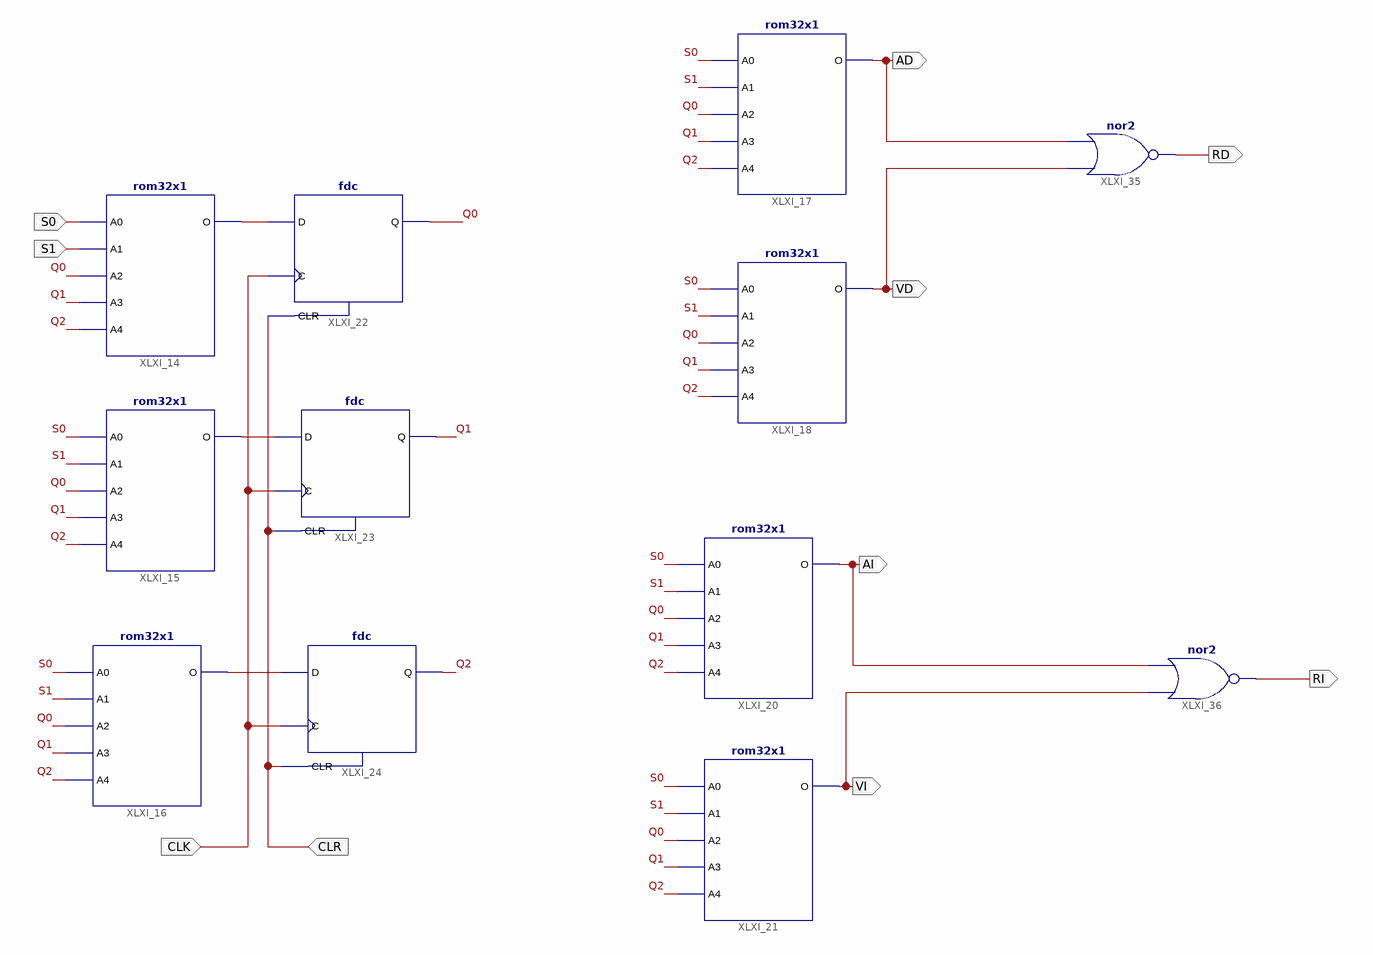
[diagram p0: schematic sheet 1]
// Xilinx ISE schematic p4ej2_1.sch (spartan3) as structural Verilog: 12 symbols, 10 ports
module p4ej2_1 (
  input  CLK,
  input  CLR,
  input  S0,
  input  S1,
  output RD,
  output RI,
  output VI,
  output AI,
  output VD,
  output AD
);

  wire Q0, Q1, Q2, XLXN_54, XLXN_55, XLXN_147;

  rom32x1 #(.INIT("0f0a0f0c")) XLXI_14 (.A0(S0), .A1(S1), .A2(Q0), .A3(Q1), .A4(Q2), .O(XLXN_54));
  rom32x1 #(.INIT("0ff00ff0")) XLXI_15 (.A0(S0), .A1(S1), .A2(Q0), .A3(Q1), .A4(Q2), .O(XLXN_55));
  fdc XLXI_22 (.C(CLK), .CLR(CLR), .D(XLXN_54), .Q(Q0));
  fdc XLXI_23 (.C(CLK), .CLR(CLR), .D(XLXN_55), .Q(Q1));
  fdc XLXI_24 (.C(CLK), .CLR(CLR), .D(XLXN_147), .Q(Q2));
  rom32x1 #(.INIT("0ffff000")) XLXI_16 (.A0(S0), .A1(S1), .A2(Q0), .A3(Q1), .A4(Q2), .O(XLXN_147));
  nor XLXI_35 (RD, VD, AD);
  nor XLXI_36 (RI, VI, AI);
  rom32x1 #(.INIT("f0000000")) XLXI_20 (.A0(S0), .A1(S1), .A2(Q0), .A3(Q1), .A4(Q2), .O(AI));
  rom32x1 #(.INIT("0fff0000")) XLXI_21 (.A0(S0), .A1(S1), .A2(Q0), .A3(Q1), .A4(Q2), .O(VI));
  rom32x1 #(.INIT("00000fff")) XLXI_18 (.A0(S0), .A1(S1), .A2(Q0), .A3(Q1), .A4(Q2), .O(VD));
  rom32x1 #(.INIT("0000f000")) XLXI_17 (.A0(S0), .A1(S1), .A2(Q0), .A3(Q1), .A4(Q2), .O(AD));
endmodule
